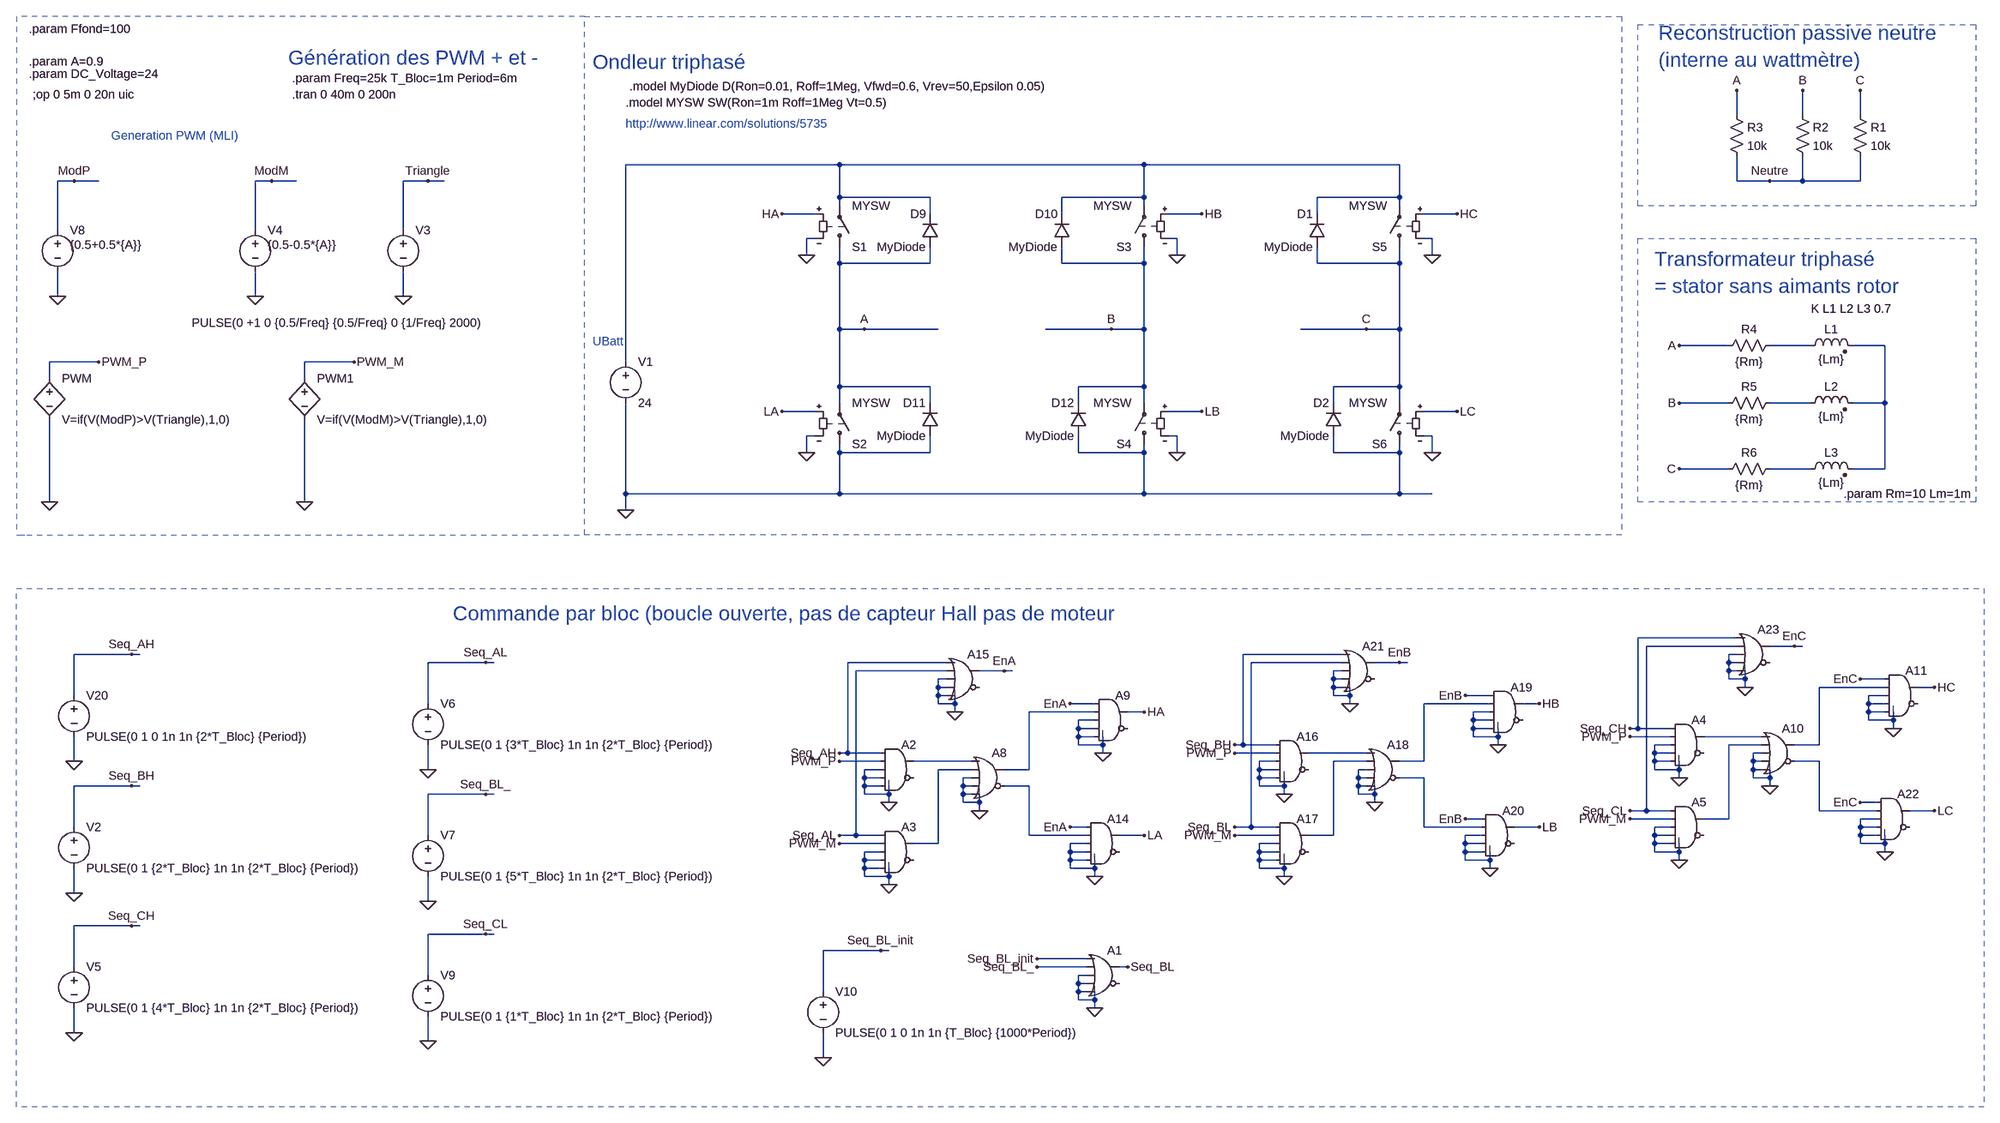
[diagram p0: schematic version_Rocacher.asc]
version_Rocacher.asc, the LTspice schematic file:
Version 4
SHEET 1 10452 1636
WIRE 9424 -592 9424 -640
WIRE 9552 -592 9552 -640
WIRE 9664 -592 9664 -640
WIRE 7680 -496 7264 -496
WIRE 8272 -496 7680 -496
WIRE 8768 -496 8272 -496
WIRE 6192 -464 6160 -464
WIRE 6240 -464 6192 -464
WIRE 6576 -464 6544 -464
WIRE 6624 -464 6576 -464
WIRE 6880 -464 6832 -464
WIRE 6912 -464 6880 -464
WIRE 9424 -464 9424 -512
WIRE 9488 -464 9424 -464
WIRE 9552 -464 9552 -512
WIRE 9552 -464 9488 -464
WIRE 9664 -464 9664 -512
WIRE 9664 -464 9552 -464
WIRE 7680 -432 7680 -496
WIRE 7856 -432 7680 -432
WIRE 8272 -432 8272 -496
WIRE 8272 -432 8112 -432
WIRE 8768 -432 8768 -496
WIRE 8768 -432 8608 -432
WIRE 7680 -416 7680 -432
WIRE 8272 -416 8272 -432
WIRE 8768 -416 8768 -432
WIRE 7632 -400 7568 -400
WIRE 7856 -400 7856 -432
WIRE 8112 -400 8112 -432
WIRE 8384 -400 8320 -400
WIRE 8608 -400 8608 -432
WIRE 8880 -400 8816 -400
WIRE 6160 -368 6160 -464
WIRE 6544 -368 6544 -464
WIRE 6832 -368 6832 -464
WIRE 7632 -352 7616 -352
WIRE 8336 -352 8320 -352
WIRE 8832 -352 8816 -352
WIRE 7616 -320 7616 -352
WIRE 8336 -320 8336 -352
WIRE 8832 -320 8832 -352
WIRE 7680 -304 7680 -336
WIRE 7856 -304 7856 -336
WIRE 7856 -304 7680 -304
WIRE 8112 -304 8112 -336
WIRE 8272 -304 8272 -336
WIRE 8272 -304 8112 -304
WIRE 8608 -304 8608 -336
WIRE 8768 -304 8768 -336
WIRE 8768 -304 8608 -304
WIRE 6160 -240 6160 -288
WIRE 6544 -240 6544 -288
WIRE 6832 -240 6832 -288
WIRE 7680 -176 7680 -304
WIRE 7728 -176 7680 -176
WIRE 7872 -176 7728 -176
WIRE 8208 -176 8080 -176
WIRE 8272 -176 8272 -304
WIRE 8272 -176 8208 -176
WIRE 8704 -176 8576 -176
WIRE 8768 -176 8768 -304
WIRE 8768 -176 8704 -176
WIRE 9408 -144 9312 -144
WIRE 9568 -144 9488 -144
WIRE 9712 -144 9648 -144
WIRE 6240 -112 6144 -112
WIRE 6736 -112 6640 -112
WIRE 7264 -112 7264 -496
WIRE 6144 -80 6144 -112
WIRE 6640 -80 6640 -112
WIRE 7680 -64 7680 -176
WIRE 7856 -64 7680 -64
WIRE 8272 -64 8272 -176
WIRE 8272 -64 8144 -64
WIRE 8768 -64 8768 -176
WIRE 8768 -64 8640 -64
WIRE 7680 -32 7680 -64
WIRE 7856 -32 7856 -64
WIRE 8144 -32 8144 -64
WIRE 8272 -32 8272 -64
WIRE 8640 -32 8640 -64
WIRE 8768 -32 8768 -64
WIRE 9408 -32 9312 -32
WIRE 9568 -32 9488 -32
WIRE 9712 -32 9712 -144
WIRE 9712 -32 9648 -32
WIRE 7632 -16 7568 -16
WIRE 8384 -16 8320 -16
WIRE 8880 -16 8816 -16
WIRE 7632 32 7616 32
WIRE 8336 32 8320 32
WIRE 8832 32 8816 32
WIRE 7616 64 7616 32
WIRE 7680 64 7680 48
WIRE 7856 64 7856 32
WIRE 7856 64 7680 64
WIRE 8144 64 8144 32
WIRE 8272 64 8272 48
WIRE 8272 64 8144 64
WIRE 8336 64 8336 32
WIRE 8640 64 8640 32
WIRE 8768 64 8768 48
WIRE 8768 64 8640 64
WIRE 8832 64 8832 32
WIRE 9408 96 9312 96
WIRE 9568 96 9488 96
WIRE 9712 96 9712 -32
WIRE 9712 96 9648 96
WIRE 7264 144 7264 -32
WIRE 7680 144 7680 64
WIRE 7680 144 7264 144
WIRE 8272 144 8272 64
WIRE 8272 144 7680 144
WIRE 8768 144 8768 64
WIRE 8768 144 8272 144
WIRE 8832 144 8768 144
WIRE 6144 160 6144 0
WIRE 6640 160 6640 0
WIRE 7264 176 7264 144
WIRE 9424 448 9232 448
WIRE 9424 464 9248 464
WIRE 9536 464 9488 464
WIRE 9552 464 9536 464
WIRE 6304 480 6192 480
WIRE 6320 480 6304 480
WIRE 8656 480 8464 480
WIRE 9424 480 9408 480
WIRE 6992 496 6880 496
WIRE 7008 496 6992 496
WIRE 7888 496 7696 496
WIRE 8656 496 8480 496
WIRE 8768 496 8720 496
WIRE 8784 496 8768 496
WIRE 9408 496 9408 480
WIRE 9424 496 9408 496
WIRE 7888 512 7712 512
WIRE 8000 512 7952 512
WIRE 8016 512 8000 512
WIRE 8656 512 8640 512
WIRE 9408 512 9408 496
WIRE 9424 512 9408 512
WIRE 7888 528 7872 528
WIRE 8640 528 8640 512
WIRE 8656 528 8640 528
WIRE 9408 528 9408 512
WIRE 9440 528 9440 512
WIRE 9440 528 9408 528
WIRE 9712 528 9664 528
WIRE 7872 544 7872 528
WIRE 7888 544 7872 544
WIRE 8640 544 8640 528
WIRE 8656 544 8640 544
WIRE 9440 544 9440 528
WIRE 9712 544 9584 544
WIRE 9808 544 9776 544
WIRE 6192 560 6192 480
WIRE 7872 560 7872 544
WIRE 7888 560 7872 560
WIRE 8640 560 8640 544
WIRE 8672 560 8672 544
WIRE 8672 560 8640 560
WIRE 8944 560 8896 560
WIRE 9712 560 9680 560
WIRE 6880 576 6880 496
WIRE 7872 576 7872 560
WIRE 7904 576 7904 560
WIRE 7904 576 7872 576
WIRE 8176 576 8128 576
WIRE 8672 576 8672 560
WIRE 8944 576 8816 576
WIRE 9040 576 9008 576
WIRE 9680 576 9680 560
WIRE 9712 576 9680 576
WIRE 7904 592 7904 576
WIRE 8176 592 8048 592
WIRE 8272 592 8240 592
WIRE 8944 592 8912 592
WIRE 9680 592 9680 576
WIRE 9712 592 9680 592
WIRE 8176 608 8144 608
WIRE 8912 608 8912 592
WIRE 8944 608 8912 608
WIRE 9680 608 9680 592
WIRE 9728 608 9728 592
WIRE 9728 608 9680 608
WIRE 8144 624 8144 608
WIRE 8176 624 8144 624
WIRE 8912 624 8912 608
WIRE 8944 624 8912 624
WIRE 9232 624 9232 448
WIRE 9232 624 9216 624
WIRE 9296 624 9232 624
WIRE 9728 624 9728 608
WIRE 8144 640 8144 624
WIRE 8176 640 8144 640
WIRE 8912 640 8912 624
WIRE 8960 640 8960 624
WIRE 8960 640 8912 640
WIRE 9296 640 9216 640
WIRE 9472 640 9360 640
WIRE 8144 656 8144 640
WIRE 8192 656 8192 640
WIRE 8192 656 8144 656
WIRE 8464 656 8464 480
WIRE 8464 656 8448 656
WIRE 8528 656 8464 656
WIRE 8960 656 8960 640
WIRE 9296 656 9264 656
WIRE 9472 656 9408 656
WIRE 9584 656 9584 544
WIRE 9584 656 9536 656
WIRE 7696 672 7696 496
WIRE 7696 672 7680 672
WIRE 7760 672 7696 672
WIRE 8192 672 8192 656
WIRE 8528 672 8448 672
WIRE 8704 672 8592 672
WIRE 9264 672 9264 656
WIRE 9296 672 9264 672
WIRE 9472 672 9456 672
WIRE 6192 688 6192 640
WIRE 7760 688 7680 688
WIRE 7936 688 7824 688
WIRE 8528 688 8496 688
WIRE 8704 688 8640 688
WIRE 8816 688 8816 576
WIRE 8816 688 8768 688
WIRE 9264 688 9264 672
WIRE 9296 688 9264 688
WIRE 9456 688 9456 672
WIRE 9472 688 9456 688
WIRE 9584 688 9536 688
WIRE 6880 704 6880 656
WIRE 7760 704 7728 704
WIRE 7936 704 7872 704
WIRE 8048 704 8048 592
WIRE 8048 704 8000 704
WIRE 8496 704 8496 688
WIRE 8528 704 8496 704
WIRE 8704 704 8688 704
WIRE 9264 704 9264 688
WIRE 9312 704 9312 688
WIRE 9312 704 9264 704
WIRE 9456 704 9456 688
WIRE 9472 704 9456 704
WIRE 7728 720 7728 704
WIRE 7760 720 7728 720
WIRE 7936 720 7920 720
WIRE 8496 720 8496 704
WIRE 8528 720 8496 720
WIRE 8688 720 8688 704
WIRE 8704 720 8688 720
WIRE 8816 720 8768 720
WIRE 9312 720 9312 704
WIRE 9456 720 9456 704
WIRE 9488 720 9488 704
WIRE 9488 720 9456 720
WIRE 6304 736 6192 736
WIRE 6320 736 6304 736
WIRE 7728 736 7728 720
WIRE 7760 736 7728 736
WIRE 7920 736 7920 720
WIRE 7936 736 7920 736
WIRE 8048 736 8000 736
WIRE 8496 736 8496 720
WIRE 8544 736 8544 720
WIRE 8544 736 8496 736
WIRE 8688 736 8688 720
WIRE 8704 736 8688 736
WIRE 9488 736 9488 720
WIRE 6992 752 6880 752
WIRE 7008 752 6992 752
WIRE 7728 752 7728 736
WIRE 7776 752 7776 736
WIRE 7776 752 7728 752
WIRE 7920 752 7920 736
WIRE 7936 752 7920 752
WIRE 8544 752 8544 736
WIRE 8688 752 8688 736
WIRE 8720 752 8720 736
WIRE 8720 752 8688 752
WIRE 7776 768 7776 752
WIRE 7920 768 7920 752
WIRE 7952 768 7952 752
WIRE 7952 768 7920 768
WIRE 8720 768 8720 752
WIRE 9696 768 9664 768
WIRE 7952 784 7952 768
WIRE 9248 784 9248 464
WIRE 9248 784 9216 784
WIRE 9296 784 9248 784
WIRE 9584 784 9584 688
WIRE 9696 784 9584 784
WIRE 9808 784 9760 784
WIRE 8928 800 8896 800
WIRE 9296 800 9216 800
WIRE 9408 800 9408 656
WIRE 9408 800 9360 800
WIRE 9696 800 9664 800
WIRE 6192 816 6192 736
WIRE 8160 816 8128 816
WIRE 8480 816 8480 496
WIRE 8480 816 8448 816
WIRE 8528 816 8480 816
WIRE 8816 816 8816 720
WIRE 8928 816 8816 816
WIRE 9040 816 8992 816
WIRE 9296 816 9264 816
WIRE 9664 816 9664 800
WIRE 9696 816 9664 816
WIRE 6880 832 6880 752
WIRE 7712 832 7712 512
WIRE 7712 832 7680 832
WIRE 7760 832 7712 832
WIRE 8048 832 8048 736
WIRE 8160 832 8048 832
WIRE 8272 832 8224 832
WIRE 8528 832 8448 832
WIRE 8640 832 8640 688
WIRE 8640 832 8592 832
WIRE 8928 832 8896 832
WIRE 9264 832 9264 816
WIRE 9296 832 9264 832
WIRE 9664 832 9664 816
WIRE 9696 832 9664 832
WIRE 7760 848 7680 848
WIRE 7872 848 7872 704
WIRE 7872 848 7824 848
WIRE 8160 848 8128 848
WIRE 8528 848 8496 848
WIRE 8896 848 8896 832
WIRE 8928 848 8896 848
WIRE 9264 848 9264 832
WIRE 9296 848 9264 848
WIRE 9664 848 9664 832
WIRE 9712 848 9712 832
WIRE 9712 848 9664 848
WIRE 7760 864 7728 864
WIRE 8128 864 8128 848
WIRE 8160 864 8128 864
WIRE 8496 864 8496 848
WIRE 8528 864 8496 864
WIRE 8896 864 8896 848
WIRE 8928 864 8896 864
WIRE 9264 864 9264 848
WIRE 9312 864 9312 848
WIRE 9312 864 9264 864
WIRE 9712 864 9712 848
WIRE 7728 880 7728 864
WIRE 7760 880 7728 880
WIRE 8128 880 8128 864
WIRE 8160 880 8128 880
WIRE 8496 880 8496 864
WIRE 8528 880 8496 880
WIRE 8896 880 8896 864
WIRE 8944 880 8944 864
WIRE 8944 880 8896 880
WIRE 9312 880 9312 864
WIRE 7728 896 7728 880
WIRE 7760 896 7728 896
WIRE 8128 896 8128 880
WIRE 8176 896 8176 880
WIRE 8176 896 8128 896
WIRE 8496 896 8496 880
WIRE 8544 896 8544 880
WIRE 8544 896 8496 896
WIRE 8944 896 8944 880
WIRE 7728 912 7728 896
WIRE 7776 912 7776 896
WIRE 7776 912 7728 912
WIRE 8176 912 8176 896
WIRE 8544 912 8544 896
WIRE 7776 928 7776 912
WIRE 6192 944 6192 896
WIRE 6880 960 6880 912
WIRE 6304 1008 6192 1008
WIRE 6320 1008 6304 1008
WIRE 6992 1024 6880 1024
WIRE 7008 1024 6992 1024
WIRE 7760 1056 7648 1056
WIRE 7776 1056 7760 1056
WIRE 8160 1072 8064 1072
WIRE 6192 1088 6192 1008
WIRE 8160 1088 8064 1088
WIRE 8240 1088 8224 1088
WIRE 6880 1104 6880 1024
WIRE 8160 1104 8144 1104
WIRE 8144 1120 8144 1104
WIRE 8160 1120 8144 1120
WIRE 7648 1136 7648 1056
WIRE 8144 1136 8144 1120
WIRE 8160 1136 8144 1136
WIRE 8144 1152 8144 1136
WIRE 8176 1152 8176 1136
WIRE 8176 1152 8144 1152
WIRE 8176 1168 8176 1152
WIRE 6192 1216 6192 1168
WIRE 6880 1232 6880 1184
WIRE 7648 1264 7648 1216
FLAG 7264 176 0
FLAG 6576 -464 ModM
FLAG 6832 -240 0
FLAG 6544 -240 0
FLAG 6880 -464 Triangle
FLAG 6144 160 0
FLAG 6240 -112 PWM_P
FLAG 7568 -400 HA
FLAG 7568 -16 LA
FLAG 7728 -176 A
FLAG 8208 -176 B
FLAG 6192 -464 ModP
FLAG 6160 -240 0
FLAG 6640 160 0
FLAG 6736 -112 PWM_M
FLAG 7616 -320 0
FLAG 7616 64 0
FLAG 8384 -400 HB
FLAG 8384 -16 LB
FLAG 8336 -320 0
FLAG 8336 64 0
FLAG 8704 -176 C
FLAG 8880 -400 HC
FLAG 8880 -16 LC
FLAG 8832 -320 0
FLAG 8832 64 0
FLAG 6192 688 0
FLAG 6304 480 Seq_AH
FLAG 6192 944 0
FLAG 6304 736 Seq_BH
FLAG 6192 1216 0
FLAG 6304 1008 Seq_CH
FLAG 6880 704 0
FLAG 6992 496 Seq_AL
FLAG 6880 960 0
FLAG 6992 752 Seq_BL_
FLAG 6880 1232 0
FLAG 6992 1024 Seq_CL
FLAG 7648 1264 0
FLAG 7760 1056 Seq_BL_init
FLAG 8176 1168 0
FLAG 8064 1072 Seq_BL_init
FLAG 8064 1088 Seq_BL_
FLAG 8240 1088 Seq_BL
FLAG 7776 768 0
FLAG 8272 592 HA
FLAG 7680 672 Seq_AH
FLAG 7680 688 PWM_P
FLAG 7776 928 0
FLAG 8272 832 LA
FLAG 7680 832 Seq_AL
FLAG 7680 848 PWM_M
FLAG 9488 -464 Neutre
FLAG 7952 784 0
FLAG 8192 672 0
FLAG 8176 912 0
FLAG 7904 592 0
FLAG 8000 512 EnA
FLAG 8128 576 EnA
FLAG 8128 816 EnA
FLAG 8544 752 0
FLAG 9040 576 HB
FLAG 8448 656 Seq_BH
FLAG 8448 672 PWM_P
FLAG 8544 912 0
FLAG 9040 816 LB
FLAG 8448 816 Seq_BL
FLAG 8448 832 PWM_M
FLAG 8720 768 0
FLAG 8960 656 0
FLAG 8944 896 0
FLAG 8672 576 0
FLAG 8768 496 EnB
FLAG 8896 560 EnB
FLAG 8896 800 EnB
FLAG 9312 720 0
FLAG 9808 544 HC
FLAG 9216 624 Seq_CH
FLAG 9216 640 PWM_P
FLAG 9312 880 0
FLAG 9808 784 LC
FLAG 9216 784 Seq_CL
FLAG 9216 800 PWM_M
FLAG 9488 736 0
FLAG 9728 624 0
FLAG 9712 864 0
FLAG 9440 544 0
FLAG 9536 464 EnC
FLAG 9664 528 EnC
FLAG 9664 768 EnC
FLAG 9424 -640 A
FLAG 9552 -640 B
FLAG 9664 -640 C
FLAG 9312 -144 A
FLAG 9312 -32 B
FLAG 9312 96 C
SYMBOL voltage 7264 -128 R0
WINDOW 123 0 0 Left 2
WINDOW 39 0 0 Left 2
SYMATTR InstName V1
SYMATTR Value 24
SYMBOL voltage 6832 -384 R0
WINDOW 123 0 0 Left 2
WINDOW 39 0 0 Left 2
WINDOW 3 -411 196 Left 2
SYMATTR Value PULSE(0 +1 0 {0.5/Freq} {0.5/Freq} 0 {1/Freq} 2000)
SYMATTR InstName V3
SYMBOL voltage 6544 -384 R0
WINDOW 123 0 0 Left 2
WINDOW 39 0 0 Left 2
WINDOW 3 24 44 Left 2
SYMATTR Value {0.5-0.5*{A}}
SYMATTR InstName V4
SYMBOL bv 6144 -96 R0
SYMATTR InstName PWM
SYMATTR Value V=if(V(ModP)>V(Triangle),1,0)
SYMBOL voltage 6160 -384 R0
WINDOW 123 0 0 Left 2
WINDOW 39 0 0 Left 2
WINDOW 3 24 44 Left 2
SYMATTR Value {0.5+0.5*{A}}
SYMATTR InstName V8
SYMBOL bv 6640 -96 R0
SYMATTR InstName PWM1
SYMATTR Value V=if(V(ModM)>V(Triangle),1,0)
SYMBOL sw 7680 -320 M180
SYMATTR InstName S1
SYMATTR Value MYSW
SYMBOL sw 7680 64 M180
SYMATTR InstName S2
SYMATTR Value MYSW
SYMBOL sw 8272 -320 R180
SYMATTR InstName S3
SYMATTR Value MYSW
SYMBOL sw 8272 64 R180
SYMATTR InstName S4
SYMATTR Value MYSW
SYMBOL diode 7872 -336 R180
WINDOW 0 24 64 Left 2
WINDOW 3 24 0 Left 2
SYMATTR InstName D9
SYMATTR Value MyDiode
SYMBOL diode 8128 -336 R180
WINDOW 0 24 64 Left 2
WINDOW 3 24 0 Left 2
SYMATTR InstName D10
SYMATTR Value MyDiode
SYMBOL diode 7872 32 R180
WINDOW 0 24 64 Left 2
WINDOW 3 24 0 Left 2
SYMATTR InstName D11
SYMATTR Value MyDiode
SYMBOL diode 8160 32 R180
WINDOW 0 24 64 Left 2
WINDOW 3 24 0 Left 2
SYMATTR InstName D12
SYMATTR Value MyDiode
SYMBOL sw 8768 -320 R180
SYMATTR InstName S5
SYMATTR Value MYSW
SYMBOL sw 8768 64 R180
SYMATTR InstName S6
SYMATTR Value MYSW
SYMBOL diode 8624 -336 R180
WINDOW 0 24 64 Left 2
WINDOW 3 24 0 Left 2
SYMATTR InstName D1
SYMATTR Value MyDiode
SYMBOL diode 8656 32 R180
WINDOW 0 24 64 Left 2
WINDOW 3 24 0 Left 2
SYMATTR InstName D2
SYMATTR Value MyDiode
SYMBOL voltage 6192 544 R0
WINDOW 123 0 0 Left 0
WINDOW 39 0 0 Left 0
SYMATTR InstName V20
SYMATTR Value PULSE(0 1 0 1n 1n {2*T_Bloc} {Period})
SYMBOL voltage 6192 800 R0
WINDOW 123 0 0 Left 0
WINDOW 39 0 0 Left 0
SYMATTR InstName V2
SYMATTR Value PULSE(0 1 {2*T_Bloc} 1n 1n {2*T_Bloc} {Period})
SYMBOL voltage 6192 1072 R0
WINDOW 123 0 0 Left 0
WINDOW 39 0 0 Left 0
SYMATTR InstName V5
SYMATTR Value PULSE(0 1 {4*T_Bloc} 1n 1n {2*T_Bloc} {Period})
SYMBOL voltage 6880 560 R0
WINDOW 123 0 0 Left 0
WINDOW 39 0 0 Left 0
SYMATTR InstName V6
SYMATTR Value PULSE(0 1 {3*T_Bloc} 1n 1n {2*T_Bloc} {Period})
SYMBOL voltage 6880 816 R0
WINDOW 123 0 0 Left 0
WINDOW 39 0 0 Left 0
SYMATTR InstName V7
SYMATTR Value PULSE(0 1 {5*T_Bloc} 1n 1n {2*T_Bloc} {Period})
SYMBOL voltage 6880 1088 R0
WINDOW 123 0 0 Left 0
WINDOW 39 0 0 Left 0
SYMATTR InstName V9
SYMATTR Value PULSE(0 1 {1*T_Bloc} 1n 1n {2*T_Bloc} {Period})
SYMBOL voltage 7648 1120 R0
WINDOW 123 0 0 Left 0
WINDOW 39 0 0 Left 0
SYMATTR InstName V10
SYMATTR Value PULSE(0 1 0 1n 1n {T_Bloc} {1000*Period})
SYMBOL Digital\\or 8192 1040 R0
SYMATTR InstName A1
SYMBOL Digital\\and 7792 640 R0
SYMATTR InstName A2
SYMBOL Digital\\and 7792 800 R0
SYMATTR InstName A3
SYMBOL res 9648 -608 R0
SYMATTR InstName R1
SYMATTR Value 10k
SYMBOL res 9536 -608 R0
SYMATTR InstName R2
SYMATTR Value 10k
SYMBOL res 9408 -608 R0
SYMATTR InstName R3
SYMATTR Value 10k
SYMBOL res 9504 -160 R90
WINDOW 0 0 56 VBottom 2
WINDOW 3 32 56 VTop 2
SYMATTR InstName R4
SYMATTR Value {Rm}
SYMBOL ind2 9552 -128 R270
WINDOW 0 32 56 VTop 2
WINDOW 3 5 56 VBottom 2
SYMATTR InstName L1
SYMATTR Value {Lm}
SYMATTR Type ind
SYMBOL res 9504 -48 R90
WINDOW 0 0 56 VBottom 2
WINDOW 3 32 56 VTop 2
SYMATTR InstName R5
SYMATTR Value {Rm}
SYMBOL ind2 9552 -16 R270
WINDOW 0 32 56 VTop 2
WINDOW 3 5 56 VBottom 2
SYMATTR InstName L2
SYMATTR Value {Lm}
SYMATTR Type ind
SYMBOL res 9504 80 R90
WINDOW 0 0 56 VBottom 2
WINDOW 3 32 56 VTop 2
SYMATTR InstName R6
SYMATTR Value {Rm}
SYMBOL ind2 9552 112 R270
WINDOW 0 32 56 VTop 2
WINDOW 3 5 56 VBottom 2
SYMATTR InstName L3
SYMATTR Value {Lm}
SYMATTR Type ind
SYMBOL Digital\\or 7968 656 R0
SYMATTR InstName A8
SYMBOL Digital\\and 8208 544 R0
SYMATTR InstName A9
SYMBOL Digital\\and 8192 784 R0
SYMATTR InstName A14
SYMBOL Digital\\or 7920 464 R0
SYMATTR InstName A15
SYMBOL Digital\\and 8560 624 R0
SYMATTR InstName A16
SYMBOL Digital\\and 8560 784 R0
SYMATTR InstName A17
SYMBOL Digital\\or 8736 640 R0
SYMATTR InstName A18
SYMBOL Digital\\and 8976 528 R0
SYMATTR InstName A19
SYMBOL Digital\\and 8960 768 R0
SYMATTR InstName A20
SYMBOL Digital\\or 8688 448 R0
SYMATTR InstName A21
SYMBOL Digital\\and 9328 592 R0
SYMATTR InstName A4
SYMBOL Digital\\and 9328 752 R0
SYMATTR InstName A5
SYMBOL Digital\\or 9504 608 R0
SYMATTR InstName A10
SYMBOL Digital\\and 9744 496 R0
SYMATTR InstName A11
SYMBOL Digital\\and 9728 736 R0
SYMATTR InstName A22
SYMBOL Digital\\or 9456 416 R0
SYMATTR InstName A23
TEXT 7264 -616 Left 2 !.model MYSW SW(Ron=1m Roff=1Meg Vt=0.5)
TEXT 6616 -632 Left 2 !.tran 0 40m 0 200n
TEXT 7264 -576 Left 2 ;http://www.linear.com/solutions/5735
TEXT 7200 -696 Left 4 ;Ondleur triphasé
TEXT 6608 -704 Left 4 ;Génération des PWM + et -
TEXT 6616 -664 Left 2 !.param Freq=25k T_Bloc=1m Period=6m
TEXT 7200 -152 Left 2 ;UBatt
TEXT 6264 -552 Left 2 ;Generation PWM (MLI)
TEXT 6112 -632 Left 2 !;op 0 5m 0 20n uic
TEXT 7272 -648 Left 2 !.model MyDiode D(Ron=0.01, Roff=1Meg, Vfwd=0.6, Vrev=50,Epsilon 0.05)
TEXT 6104 -760 Left 2 !.param Ffond=100
TEXT 6104 -696 Left 2 !.param A=0.9
TEXT 6104 -672 Left 2 !.param DC_Voltage=24
TEXT 9568 -216 Left 2 !K L1 L2 L3 0.7
TEXT 6928 400 Left 4 ;Commande par bloc (boucle ouverte, pas de capteur Hall pas de moteur
TEXT 9264 -312 Left 4 ;Transformateur triphasé\n= stator sans aimants rotor
TEXT 9272 -752 Left 4 ;Reconstruction passive neutre\n(interne au wattmètre)
TEXT 9632 144 Left 2 !.param Rm=10 Lm=1m
LINE Normal 7184 -784 8704 -784 2
LINE Normal 8704 224 7184 224 2
LINE Normal 9200 224 8704 224 2
LINE Normal 9200 -784 9200 224 2
LINE Normal 8704 -784 9200 -784 2
LINE Normal 6080 -784 6080 -784 2
LINE Normal 6080 224 6096 224 2
RECTANGLE Normal 6080 224 7184 -784 2
RECTANGLE Normal 9888 -416 9232 -768 2
RECTANGLE Normal 9888 160 9232 -352 2
RECTANGLE Normal 9904 1360 6080 352 2

The netlist it stands for:
* version_Rocacher.asc
V1 N001 0 24
V3 Triangle 0 PULSE(0 +1 0 {0.5/Freq} {0.5/Freq} 0 {1/Freq} 2000)
V4 ModM 0 {0.5-0.5*{A}}
B§PWM PWM_P 0 V=if(V(ModP)>V(Triangle),1,0)
V8 ModP 0 {0.5+0.5*{A}}
B§PWM1 PWM_M 0 V=if(V(ModM)>V(Triangle),1,0)
S1 A N001 HA 0 MYSW
S2 0 A LA 0 MYSW
S3 B N001 HB 0 MYSW
S4 0 B LB 0 MYSW
D9 A N001 MyDiode
D10 B N001 MyDiode
D11 0 A MyDiode
D12 0 B MyDiode
S5 C N001 HC 0 MYSW
S6 0 C LC 0 MYSW
D1 C N001 MyDiode
D2 0 C MyDiode
V20 Seq_AH 0 PULSE(0 1 0 1n 1n {2*T_Bloc} {Period})
V2 Seq_BH 0 PULSE(0 1 {2*T_Bloc} 1n 1n {2*T_Bloc} {Period})
V5 Seq_CH 0 PULSE(0 1 {4*T_Bloc} 1n 1n {2*T_Bloc} {Period})
V6 Seq_AL 0 PULSE(0 1 {3*T_Bloc} 1n 1n {2*T_Bloc} {Period})
V7 Seq_BL_ 0 PULSE(0 1 {5*T_Bloc} 1n 1n {2*T_Bloc} {Period})
V9 Seq_CL 0 PULSE(0 1 {1*T_Bloc} 1n 1n {2*T_Bloc} {Period})
V10 Seq_BL_init 0 PULSE(0 1 0 1n 1n {T_Bloc} {1000*Period})
A1 Seq_BL_init Seq_BL_ 0 0 0 0 Seq_BL 0 OR
A2 Seq_AH PWM_P 0 0 0 0 N012 0 AND
A3 Seq_AL PWM_M 0 0 0 0 N015 0 AND
R1 C Neutre 10k
R2 B Neutre 10k
R3 A Neutre 10k
R4 N002 A {Rm}
L1 N002 N003 {Lm}
R5 N004 B {Rm}
L2 N004 N003 {Lm}
R6 N005 C {Rm}
L3 N005 N003 {Lm}
A8 N012 N015 0 0 0 N017 N008 0 OR
A9 EnA N008 0 0 0 0 HA 0 AND
A14 EnA N017 0 0 0 0 LA 0 AND
A15 Seq_AH Seq_AL 0 0 0 0 EnA 0 OR
A16 Seq_BH PWM_P 0 0 0 0 N011 0 AND
A17 Seq_BL PWM_M 0 0 0 0 N013 0 AND
A18 N011 N013 0 0 0 N016 N007 0 OR
A19 EnB N007 0 0 0 0 HB 0 AND
A20 EnB N016 0 0 0 0 LB 0 AND
A21 Seq_BH Seq_BL 0 0 0 0 EnB 0 OR
A4 Seq_CH PWM_P 0 0 0 0 N009 0 AND
A5 Seq_CL PWM_M 0 0 0 0 N010 0 AND
A10 N009 N010 0 0 0 N014 N006 0 OR
A11 EnC N006 0 0 0 0 HC 0 AND
A22 EnC N014 0 0 0 0 LC 0 AND
A23 Seq_CH Seq_CL 0 0 0 0 EnC 0 OR
.model D D
.lib standard.dio
.model MYSW SW(Ron=1m Roff=1Meg Vt=0.5)
.tran 0 40m 0 200n
* http://www.linear.com/solutions/5735
* Ondleur triphasé
* Génération des PWM + et -
.param Freq=25k T_Bloc=1m Period=6m
* UBatt
* Generation PWM (MLI)
;op 0 5m 0 20n uic
.model MyDiode D(Ron=0.01, Roff=1Meg, Vfwd=0.6, Vrev=50,Epsilon 0.05)
.param Ffond=100
.param A=0.9
.param DC_Voltage=24
K L1 L2 L3 0.7
* Commande par bloc (boucle ouverte, pas de capteur Hall pas de moteur
* Transformateur triphasé
* = stator sans aimants rotor
* Reconstruction passive neutre
* (interne au wattmètre)
.param Rm=10 Lm=1m
.backanno
.end